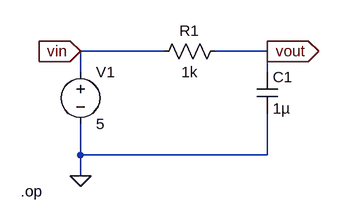
[diagram p0: schematic RC1.asc]
RC1.asc, the LTspice schematic file:
Version 4
SHEET 1 880 680
WIRE 144 96 16 96
WIRE 304 96 224 96
WIRE 16 128 16 96
WIRE 304 128 304 96
WIRE 16 256 16 208
WIRE 304 256 304 192
WIRE 304 256 16 256
WIRE 16 288 16 256
FLAG 16 288 0
FLAG 16 96 vin
IOPIN 16 96 In
FLAG 304 96 vout
IOPIN 304 96 Out
SYMBOL cap 288 128 R0
SYMATTR InstName C1
SYMATTR Value 1µ
SYMBOL res 240 80 R90
WINDOW 0 0 56 VBottom 2
WINDOW 3 32 56 VTop 2
SYMATTR InstName R1
SYMATTR Value 1k
SYMBOL voltage 16 112 R0
WINDOW 123 0 0 Left 0
WINDOW 39 0 0 Left 0
SYMATTR InstName V1
SYMATTR Value 5
TEXT -76 312 Left 2 !.op

The netlist it stands for:
* RC1.asc
C1 vout 0 1µ
R1 vout vin 1k
V1 vin 0 5
.op
.backanno
.end